# EAGLE board SMP (EAGLE 9.4.2)
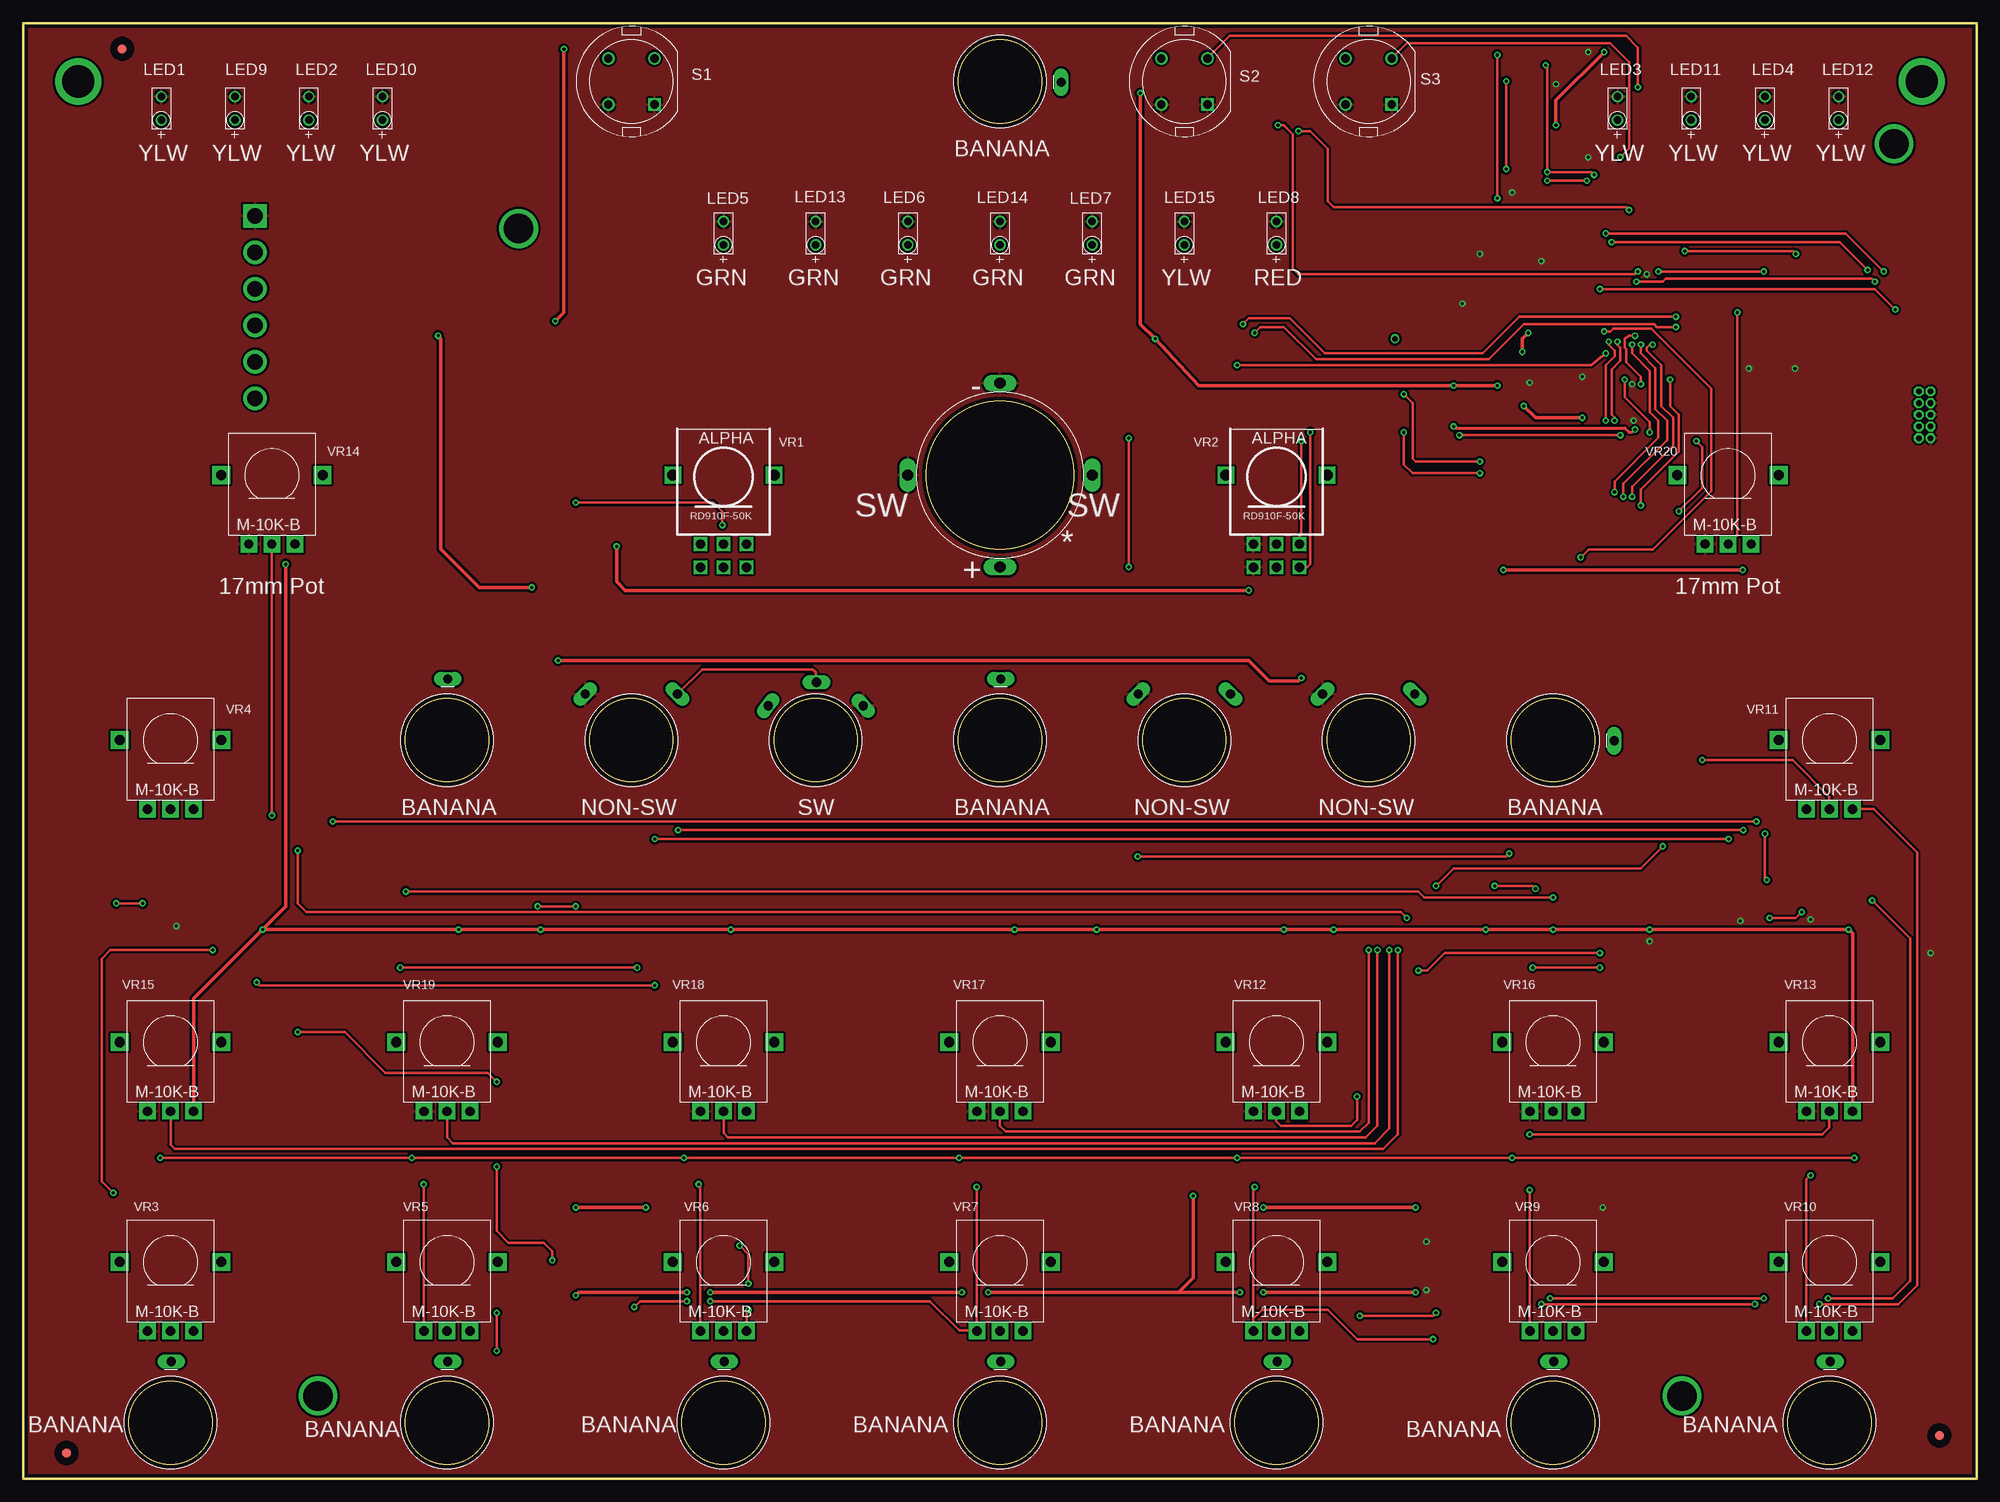
[diagram p5: board, top side]
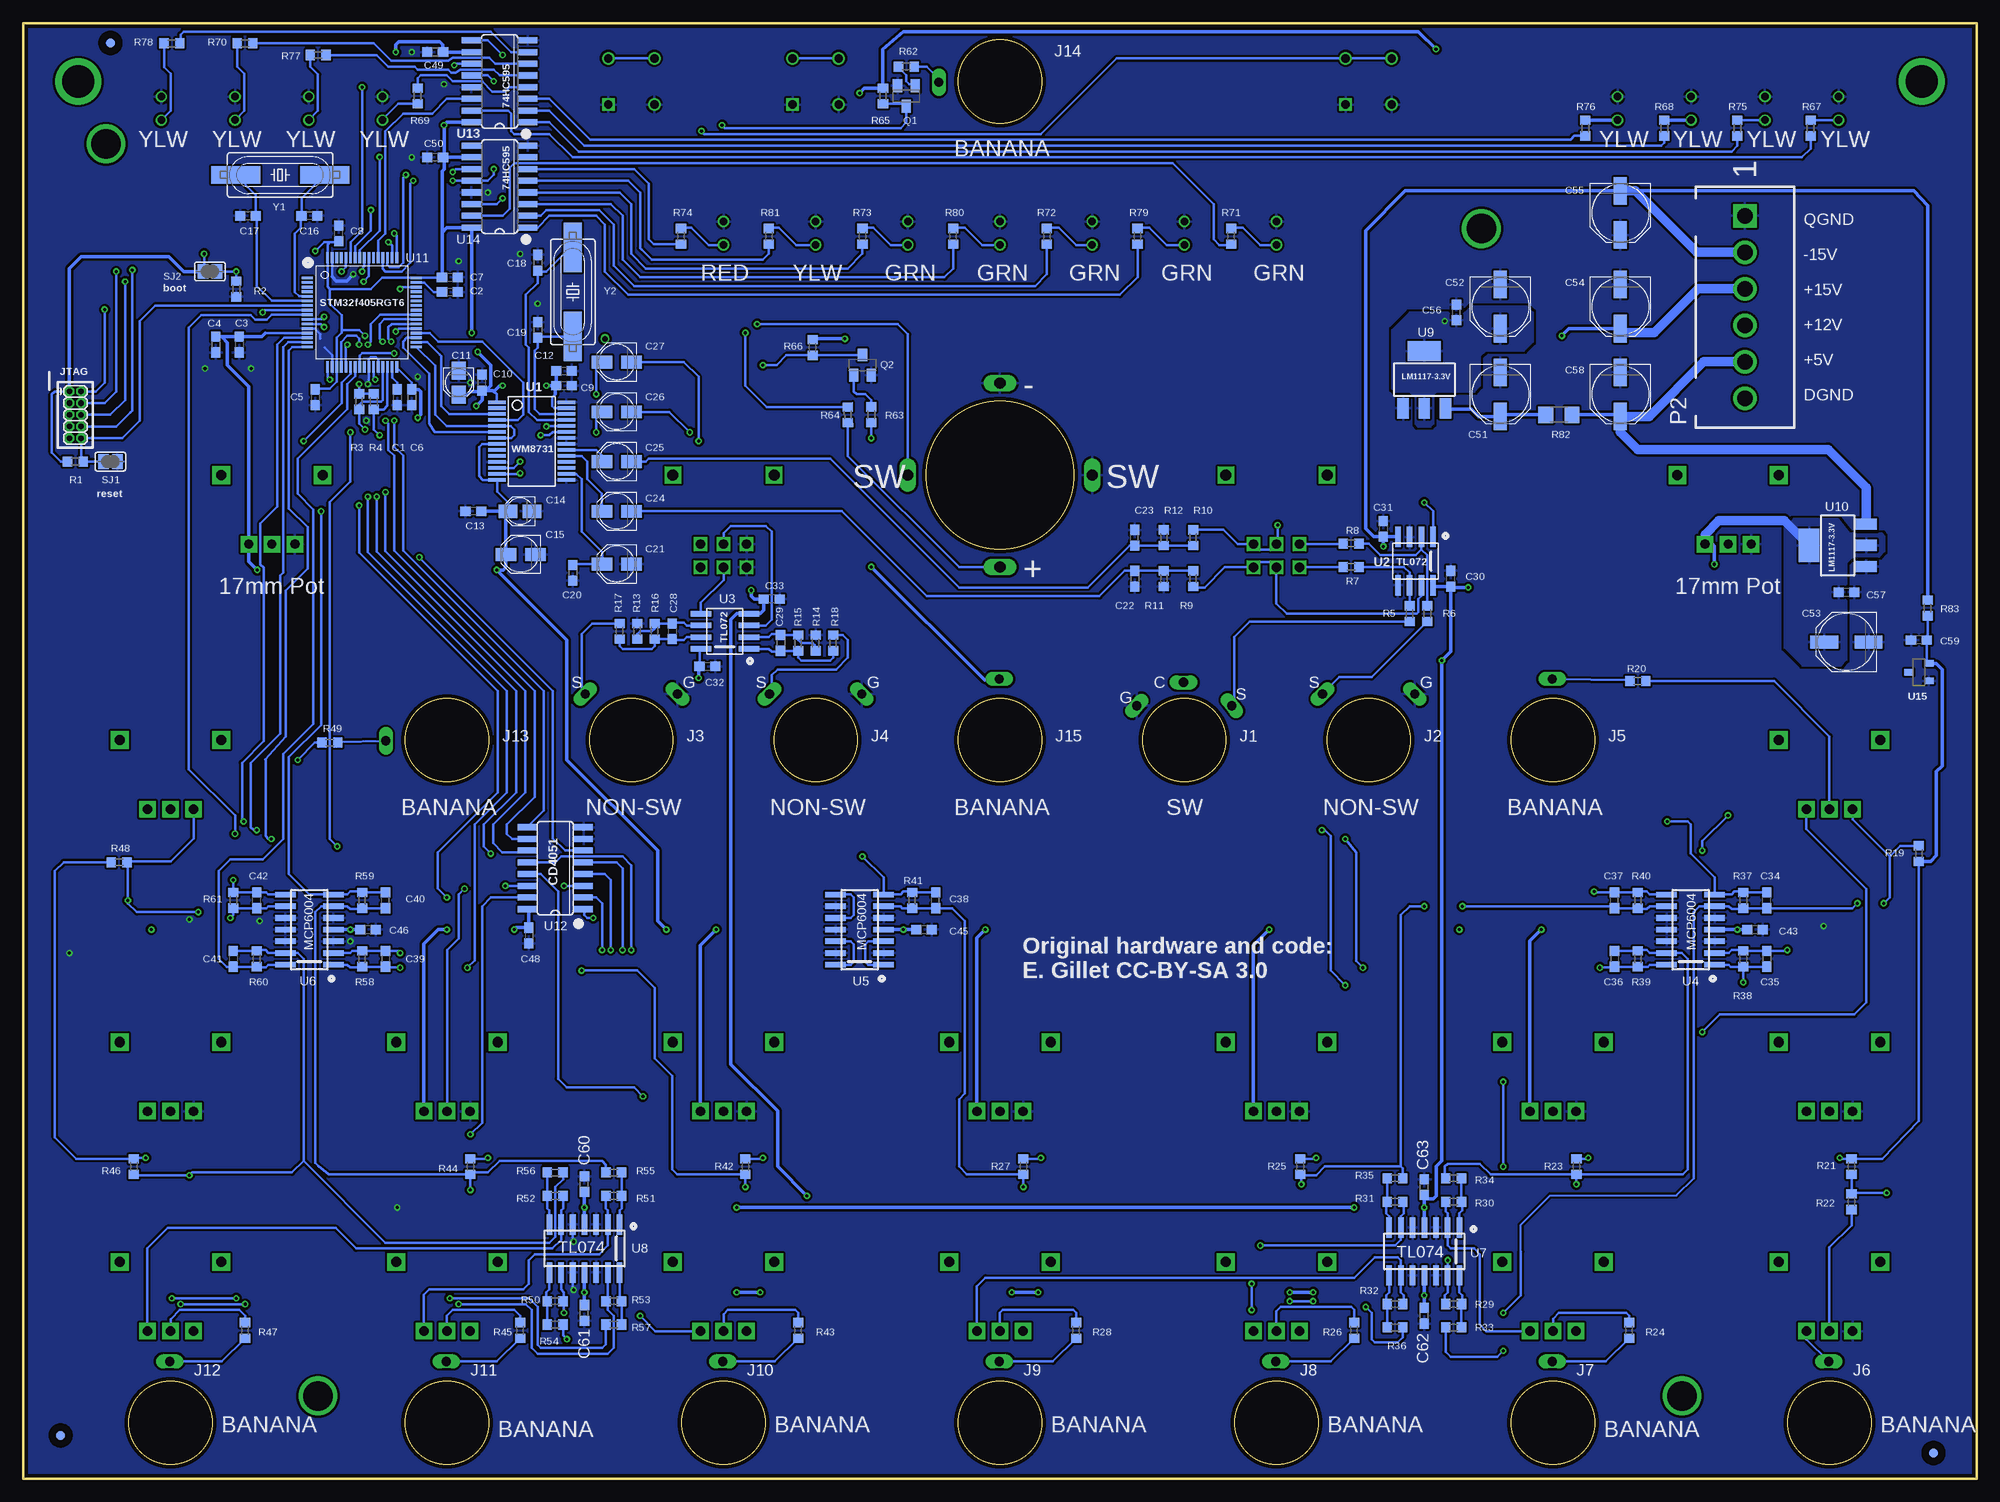
[diagram p6: board, bottom side, seen from below]

Size 212 x 158 mm. Coordinates in mm from the lower left corner, seen from the top.
Outline: 0,158 212,158 212,0 0,0 0,158
Copper layers (1*16): Top 0.0356mm / dielectric 1.5011mm / Bottom 0.0356mm
Design rules "LaenPCBOrder *": minimum track width 6mil, minimum drill 13mil, track to track 2mil, track to pad 2mil, pad to pad 2mil, via to via 6mil, smd to smd 2mil, copper to edge 15mil, drill to drill 6mil, minimum pad ring 6mil, minimum via ring 7mil, stop-mask expansion 3mil, vias tented up to drill 0mil, thermal gap 10mil
Net classes: 0 nets: width 0.203 mm, clearance 0.152 mm; 1 width: width 0.152 mm, clearance 0.152 mm

## Footprints (pad centres in the part's own frame; a part is rotated, then mirrored left to right if it is on the bottom)
C0603 = smd 1.1 x 1: 1 -0.85,0; 2 0.85,0
PANASONIC_A = smd 2 x 1.5: + 1.3,0; - -1.3,0
PANASONIC_B = smd 2.2 x 1.4: + 1.6,0; - -1.6,0
PANASONIC_D = smd 3 x 1.4: + 2.4,0; - -2.4,0
FIDUCIAL_1MM = smd 1 x 1: 1 0,0
SWITCH_JOHNSON = drill 1 long: C 0.08,6.27; G 5.16,3.73; S -5.16,3.73
SWITCH = drill 1 long: G -5,5; S 5,5
JOHNSON = drill 1 long: 1 0.08,6.635
LED_3MM_MIN = drill 0.813: A -1.27,0; K 1.27,0
2X5-1.27 = drill 0.61 pad 1.067 octagon: 1 -1.27,3.81; 2 0,3.81; 3 -1.27,2.54; 4 0,2.54; 5 -1.27,1.27; 6 0,1.27; 7 -1.27,0; 8 0,0; 9 -1.27,-1.27; 10 0,-1.27
MTA_156 = drill 1.7 square: 1 -9.9,0 | drill 1.7: 2 -5.94,0; 3 -1.98,0; 4 1.98,0; 5 5.94,0; 6 9.9,0
SOT23-BEC = smd 1 x 1.4: B -0.95,-1.1; C 0,1.1; E 0.95,-1.1
R0603 = smd 1 x 1.1: 1 -0.85,0; 2 0.85,0
R1206 = smd 1.6 x 1.803: 1 -1.422,0; 2 1.422,0
C&K_D6R = drill 0.9 square: 1 2.5,2.5 | drill 0.9: 2 2.5,-2.5; 3 -2.5,-2.5; 4 -2.5,2.5
MB16F = drill 1.2 long: 1 10,0; 2 -10,0; 3 0,10; 4 0,-10
SJ = smd 1.168 x 1.6: 1 -0.762,0; 2 0.762,0
SSOP28 = smd 0.381 x 1.905: 1 -4.55,-3.752; 2 -3.9,-3.752; 3 -3.25,-3.752; 4 -2.6,-3.752; 5 -1.95,-3.752; 6 -1.3,-3.752; 7 -0.65,-3.752; 8 0,-3.752; 9 0.65,-3.752; 10 1.3,-3.752; 11 1.95,-3.752; 12 2.6,-3.752; 13 3.25,-3.752; 14 3.9,-3.752; 15 3.9,3.752; 16 3.25,3.752; 17 2.6,3.752; 18 1.95,3.752; 19 1.3,3.752; 20 0.65,3.752; 21 0,3.752; 22 -0.65,3.752; 23 -1.3,3.752; 24 -1.95,3.752; 25 -2.6,3.752; 26 -3.25,3.752; 27 -3.9,3.752; 28 -4.55,3.752
SO08 = smd 0.61 x 2.21: 1 -1.905,-2.616; 2 -0.635,-2.616; 3 0.635,-2.616; 4 1.905,-2.616; 5 1.905,2.616; 6 0.635,2.616; 7 -0.635,2.616; 8 -1.905,2.616
SO14 = smd 0.6 x 2.2: 1 -3.81,-2.6; 2 -2.54,-2.6; 3 -1.27,-2.6; 4 0,-2.6; 5 1.27,-2.6; 6 2.54,-2.6; 7 3.81,-2.6; 8 3.81,2.6; 9 2.54,2.6; 10 1.27,2.6; 11 0,2.6; 12 -1.27,2.6; 13 -2.54,2.6; 14 -3.81,2.6
SOT223 = smd 1.219 x 2.235: 1 -2.311,-3.099; 2 0,-3.099; 3 2.311,-3.099 | smd 3.6 x 2.2: TAB 0,3.099
TQFP-10X10-64 = smd 1.2 x 0.3: 1 -5.936,3.75; 2 -5.936,3.25; 3 -5.936,2.75; 4 -5.936,2.25; 5 -5.936,1.75; 6 -5.936,1.25; 7 -5.936,0.75; 8 -5.936,0.25; 9 -5.936,-0.25; 10 -5.936,-0.75; 11 -5.936,-1.25; 12 -5.936,-1.75; 13 -5.936,-2.25; 14 -5.936,-2.75; 15 -5.936,-3.25; 16 -5.936,-3.75; 33 5.886,-3.75; 34 5.886,-3.25; 35 5.886,-2.75; 36 5.886,-2.25; 37 5.886,-1.75; 38 5.886,-1.25; 39 5.886,-0.75; 40 5.886,-0.25; 41 5.886,0.25; 42 5.886,0.75; 43 5.886,1.25; 44 5.886,1.75; 45 5.886,2.25; 46 5.886,2.75; 47 5.886,3.25; 48 5.886,3.75 | smd 0.3 x 1.2: 17 -3.75,-5.911; 18 -3.25,-5.911; 19 -2.75,-5.911; 20 -2.25,-5.911; 21 -1.75,-5.911; 22 -1.25,-5.911; 23 -0.75,-5.911; 24 -0.25,-5.911; 25 0.25,-5.911; 26 0.75,-5.911; 27 1.25,-5.911; 28 1.75,-5.911; 29 2.25,-5.911; 30 2.75,-5.911; 31 3.25,-5.911; 32 3.75,-5.911; 49 3.75,5.936; 50 3.25,5.936; 51 2.75,5.936; 52 2.25,5.936; 53 1.75,5.936; 54 1.25,5.936; 55 0.75,5.936; 56 0.25,5.936; 57 -0.25,5.936; 58 -0.75,5.936; 59 -1.25,5.936; 60 -1.75,5.936; 61 -2.25,5.936; 62 -2.75,5.936; 63 -3.25,5.936; 64 -3.75,5.936
SO16 = smd 0.66 x 2.032: 1 -4.445,-3.073; 2 -3.175,-3.073; 3 -1.905,-3.073; 4 -0.635,-3.073; 5 0.635,-3.073; 6 1.905,-3.073; 7 3.175,-3.073; 8 4.445,-3.073; 9 4.445,3.073; 10 3.175,3.073; 11 1.905,3.073; 12 0.635,3.073; 13 -0.635,3.073; 14 -1.905,3.073; 15 -3.175,3.073; 16 -4.445,3.073
DBZ_R-PDSO-G3 = smd 0.7 x 1: 1 -0.95,-1.1; 2 0.95,-1.1; 3 0,1.1
ALPHA902F = drill 1 square: 1R1 -2.5,-10; 1R2 -2.5,-7.5; 2R1 0,-10; 2R2 0,-7.5; 3R1 2.5,-10; 3R2 2.5,-7.5 | drill 1.2 square: K 5.5,0; L -5.5,0
ALPHA901F = drill 1 pad 1.778 square: 1 -2.5,-7.5; 2 0,-7.5; 3 2.5,-7.5 | drill 1.1 pad 1.93 square: H 5.5,0; I -5.5,0
HC49UP = smd 5.334 x 1.93: 1 -4.826,0; 2 4.826,0

## Placement (x,y rotation side)
C1  2.2u  [C0603]  171.41,117.38 270 bottom
C2  2.2u  [C0603]  165.69,128.81 0 bottom
C3  100n  [C0603]  188.55,123.1 270 bottom
C4  1u  [C0603]  191.09,123.1 270 bottom
C5  100n  [C0603]  180.3,117.38 270 bottom
C6  100n  [C0603]  169.82,117.38 270 bottom
C7  100n  [C0603]  165.69,130.4 0 bottom
C8  100n  [C0603]  177.75,135.16 90 bottom
C9  100n  [C0603]  153.31,118.66 0 bottom
C10  100n  [C0603]  162.2,118.97 90 bottom
C11  10u  [PANASONIC_A]  164.74,118.97 270 bottom
C12  1u  [C0603]  153.31,120.24 0 bottom
C13  100n  [C0603]  163.15,105 180 bottom
C14  10u  [PANASONIC_A]  158.07,105 180 bottom
C15  10u  [PANASONIC_B]  158,100.33 180 bottom
C16  18p  [C0603]  180.93,137.07 180 bottom
C17  18p  [C0603]  187.6,137.07 0 bottom
C18  18p  [C0603]  156.16,131.99 270 bottom
C19  18p  [C0603]  156.16,124.69 270 bottom
C20  100n  [C0603]  152.35,98.34 270 bottom
C21  10u  [PANASONIC_B]  147.59,99.29 180 bottom
C22  220p  [C0603]  91.39,97.7 270 bottom
C23  220p  [C0603]  91.39,102.14 90 bottom
C24  10u  [PANASONIC_B]  147.59,105 180 bottom
C25  10u  [PANASONIC_B]  147.59,110.4 180 bottom
C26  10u  [PANASONIC_B]  147.59,115.8 180 bottom
C27  10u  [PANASONIC_B]  147.59,121.19 180 bottom
C28  18p  [C0603]  141.56,91.98 270 bottom
C29  18p  [C0603]  129.81,90.72 270 bottom
C30  100n  [C0603]  57.1,97.7 90 bottom
C31  100n  [C0603]  64.41,103.1 270 bottom
C32  100n  [C0603]  137.75,88.17 0 bottom
C33  100n  [C0603]  130.76,95.48 180 bottom
C34  3.3n  [C0603]  22.81,62.77 90 bottom
C35  3.3n  [C0603]  22.81,56.42 270 bottom
C36  3.3n  [C0603]  39.33,56.42 270 bottom
C37  3.3n  [C0603]  39.33,62.77 90 bottom
C38  3.3n  [C0603]  112.98,62.77 90 bottom
C39  3.3n  [C0603]  172.68,56.42 270 bottom
C40  3.3n  [C0603]  172.68,62.77 90 bottom
C41  3.3n  [C0603]  189.19,56.42 270 bottom
C42  3.3n  [C0603]  186.64,62.77 90 bottom
C43  100n  [C0603]  24.08,59.6 0 bottom
C45  100n  [C0603]  114.25,59.6 0 bottom
C46  100n  [C0603]  174.58,59.6 0 bottom
C48  100n  [C0603]  157.12,58.97 270 bottom
C49  100n  [C0603]  167.28,154.85 180 bottom
C50  100n  [C0603]  167.28,143.42 180 bottom
C51  47u  [PANASONIC_D]  51.71,117.7 270 bottom
C52  47u  [PANASONIC_D]  51.71,127.23 270 bottom
C53  47u  [PANASONIC_D]  14.16,90.83 180 bottom
C54  47u  [PANASONIC_D]  38.69,127.23 270 bottom
C55  47u  [PANASONIC_D]  38.69,137.39 270 bottom
C56  100n  [C0603]  56.47,126.59 90 bottom
C57  100n  [C0603]  14.16,96.22 0 bottom
C58  47u  [PANASONIC_D]  38.69,117.7 270 bottom
C59  100n  [C0603]  6.31,91.03 180 bottom
C60  100n  [C0603]  151.09,31.98 90 bottom
C61  100n  [C0603]  151.09,18.01 90 bottom
C62  100n  [C0603]  59.96,17.69 90 bottom
C63  100n  [C0603]  59.96,31.66 90 bottom
FD1  FIDUCIAL  [FIDUCIAL_1MM]  10.75,155.2 90 top
FD2  FIDUCIAL  [FIDUCIAL_1MM]  4.72,2.8 0 top
FD3  FIDUCIAL  [FIDUCIAL_1MM]  207.92,4.7 0 top
FD4  FIDUCIAL  [FIDUCIAL_1MM]  202.52,155.83 0 bottom
FD5  FIDUCIAL  [FIDUCIAL_1MM]  4.72,2.8 0 bottom
FD6  FIDUCIAL  [FIDUCIAL_1MM]  207.92,4.7 0 bottom
J1  SWITCHCRAFT_42A  [SWITCH_JOHNSON]  86,80.17 0 top
J2  SWITCHCRAFT_JACK  [SWITCH]  66,80.17 0 top
J3  SWITCHCRAFT_JACK  [SWITCH]  146,80.17 0 top
J4  SWITCHCRAFT_JACK  [SWITCH]  126,80.17 0 top
J5  JOHNSON_BANANASTD  [JOHNSON]  46,80.17 0 top
J6  JOHNSON_BANANASTD  [JOHNSON]  16,6.09 0 top
J7  JOHNSON_BANANASTD  [JOHNSON]  46,6.09 0 top
J8  JOHNSON_BANANASTD  [JOHNSON]  76,6.09 0 top
J9  JOHNSON_BANANASTD  [JOHNSON]  106,6.09 0 top
J10  JOHNSON_BANANASTD  [JOHNSON]  136,6.09 0 top
J11  JOHNSON_BANANASTD  [JOHNSON]  166,6.09 0 top
J12  JOHNSON_BANANASTD  [JOHNSON]  196,6.09 0 top
J13  JOHNSON_BANANASTD  [JOHNSON]  166,80.17 270 top
J14  JOHNSON_BANANASTD  [JOHNSON]  106,151.66 270 top
J15  JOHNSON_BANANASTD  [JOHNSON]  106,80.17 0 top
LED1  Kingbright 754-1220  [LED_3MM_MIN]  15,148.74 90 top
LED2  Kingbright 754-1220  [LED_3MM_MIN]  31,148.74 90 top
LED3  Kingbright 754-1220  [LED_3MM_MIN]  173,148.74 90 top
LED4  Kingbright 754-1220  [LED_3MM_MIN]  189,148.74 90 top
LED5  754-1217-ND  [LED_3MM_MIN]  76,135.19 90 top
LED6  754-1217-ND  [LED_3MM_MIN]  96,135.19 90 top
LED7  754-1217-ND  [LED_3MM_MIN]  116,135.19 90 top
LED8  754-1219-ND  [LED_3MM_MIN]  136,135.19 90 top
LED9  Kingbright 754-1220  [LED_3MM_MIN]  23,148.74 90 top
LED10  Kingbright 754-1220  [LED_3MM_MIN]  39,148.74 90 top
LED11  Kingbright 754-1220  [LED_3MM_MIN]  181,148.74 90 top
LED12  Kingbright 754-1220  [LED_3MM_MIN]  197,148.74 90 top
LED13  754-1217-ND  [LED_3MM_MIN]  86,135.19 90 top
LED14  754-1217-ND  [LED_3MM_MIN]  106,135.19 90 top
LED15  Kingbright 754-1220  [LED_3MM_MIN]  126,135.19 90 top
P1  M05X2MINIJTAG  [2X5-1.27]  205.69,114.21 0 bottom
P2  BU_PWR_NO_I2C  [MTA_156]  25.18,127.17 270 bottom
Q1  MMBT3904  [SOT23-BEC]  116.16,150.09 180 bottom
Q2  MMBT3904  [SOT23-BEC]  120.92,120.88 0 bottom
R1  10k  [R0603]  206.33,110.4 180 bottom
R2  10k  [R0603]  188.87,129.13 90 bottom
R3  2.2k  [R0603]  175.53,116.91 90 bottom
R4  2.2k  [R0603]  173.94,116.91 90 bottom
R5  22k  [R0603]  61.55,93.89 270 bottom
R6  22k  [R0603]  59.65,93.89 270 bottom
R7  3.3k  [R0603]  67.9,98.97 0 bottom
R8  3.3k  [R0603]  67.9,101.51 0 bottom
R9  5.6k  [R0603]  85.05,97.7 270 bottom
R10  5.6k  [R0603]  85.05,102.14 90 bottom
R11  5.6k  [R0603]  88.22,97.7 90 bottom
R12  5.6k  [R0603]  88.22,102.14 270 bottom
R13  5K6  [R0603]  145.37,91.98 90 bottom
R14  5K6  [R0603]  126,90.72 90 bottom
R15  47k  [R0603]  127.91,90.72 90 bottom
R16  47k  [R0603]  143.47,91.98 90 bottom
R17  1.0k  [R0603]  147.28,91.98 270 bottom
R18  1.0k  [R0603]  124.1,90.72 270 bottom
R19  100k  [R0603]  6.31,67.86 90 bottom
R20  100k  [R0603]  36.78,86.59 0 bottom
R21  180k  [R0603]  13.61,33.88 270 bottom
R22  100k  [R0603]  13.61,30.07 90 bottom
R23  100k  [R0603]  43.45,33.88 270 bottom
R24  100k  [R0603]  37.74,16.1 90 bottom
R25  100k  [R0603]  73.42,33.88 270 bottom
R26  100k  [R0603]  67.58,16.1 90 bottom
R27  100k  [R0603]  103.46,33.88 270 bottom
R28  100k  [R0603]  97.75,16.1 90 bottom
R29  16.5k  [R0603]  56.79,18.96 0 bottom
R30  16.5k  [R0603]  56.79,30.07 0 bottom
R31  16.5k  [R0603]  63.14,30.07 180 bottom
R32  16.5k  [R0603]  63.14,18.96 180 bottom
R33  16.5k  [R0603]  56.79,16.42 180 bottom
R34  16.5k  [R0603]  56.79,32.61 180 bottom
R35  16.5k  [R0603]  63.14,32.61 0 bottom
R36  16.5k  [R0603]  63.14,16.42 0 bottom
R37  16.5k  [R0603]  25.36,62.77 90 bottom
R38  47k  [R0603]  25.36,56.42 270 bottom
R39  16.5k  [R0603]  36.78,56.42 270 bottom
R40  16.5k  [R0603]  36.78,62.77 90 bottom
R41  16.5k  [R0603]  115.53,62.77 90 bottom
R42  100k  [R0603]  133.62,33.88 270 bottom
R43  100k  [R0603]  127.91,16.1 90 bottom
R44  100k  [R0603]  163.47,33.88 270 bottom
R45  100k  [R0603]  158.07,16.1 90 bottom
R46  100k  [R0603]  199.98,33.88 270 bottom
R47  100k  [R0603]  187.92,16.1 90 bottom
R48  100k  [R0603]  201.57,66.9 0 bottom
R49  100k  [R0603]  178.7,79.89 180 bottom
R50  16.5k  [R0603]  154.26,19.28 180 bottom
R51  16.5k  [R0603]  147.91,30.71 0 bottom
R52  16.5k  [R0603]  154.26,30.71 180 bottom
R53  16.5k  [R0603]  147.91,19.28 0 bottom
R54  16.5k  [R0603]  154.26,16.74 0 bottom
R55  16.5k  [R0603]  147.91,33.25 180 bottom
R56  16.5k  [R0603]  154.26,33.25 0 bottom
R57  16.5k  [R0603]  147.91,16.74 180 bottom
R58  16.5k  [R0603]  175.22,56.42 270 bottom
R59  16.5k  [R0603]  175.22,62.77 90 bottom
R60  16.5k  [R0603]  186.64,56.42 270 bottom
R61  16.5k  [R0603]  189.19,62.77 90 bottom
R62  100k  [R0603]  116.16,153.26 180 bottom
R63  100k  [R0603]  119.97,115.48 90 bottom
R64  100  [R0603]  122.51,115.48 270.9 bottom
R65  10k  [R0603]  118.7,150.09 90 bottom
R66  10k  [R0603]  126.32,122.78 90 bottom
R67  1K  [R0603]  18.05,146.59 270 bottom
R68  1K  [R0603]  33.93,146.59 270 bottom
R69  1K  [R0603]  169.18,150.09 90 bottom
R70  1K  [R0603]  187.92,155.8 0 bottom
R71  100R  [R0603]  80.92,134.85 270 bottom
R72  100R  [R0603]  100.92,134.85 270 bottom
R73  100R  [R0603]  120.92,134.85 270 bottom
R74  100R  [R0603]  140.61,134.85 270 bottom
R75  1K  [R0603]  25.99,146.59 270 bottom
R76  1K  [R0603]  42.5,146.59 270 bottom
R77  1K  [R0603]  179.98,154.53 0 bottom
R78  1K  [R0603]  195.85,155.8 0 bottom
R79  100R  [R0603]  91.08,134.85 270 bottom
R80  100R  [R0603]  111.08,134.85 270 bottom
R81  100R  [R0603]  131.08,134.85 270 bottom
R82  4.7  [R1206]  45.36,115.48 180 bottom
R83  470  [R0603]  5.35,94.53 270 bottom
S1  [C&K_D6R]  66,151.66 270 top
S2  [C&K_D6R]  126,151.66 270 top
S3  [C&K_D6R]  146,151.66 270 top
S4  ATI_MB16F-Y  [MB16F]  106,108.94 180 top
SJ1  RESET  [SJ]  202.52,110.4 180 bottom
SJ2  BOOT  [SJ]  191.72,131.04 180 bottom
U1  WM8731  [SSOP28]  156.8,112.31 270 bottom
U2  TL072  [SO08]  60.91,99.61 180 bottom
U3  TL072  [SO08]  135.84,91.98 90 bottom
U4  MCP6004  [SO14]  31.07,59.6 90 bottom
U5  MCP6004  [SO14]  121.24,59.6 90 bottom
U6  MCP6004  [SO14]  180.93,59.6 90 bottom
U7  TL074  [SO14]  59.96,24.67 180 bottom
U8  TL074  [SO14]  151.09,24.99 180 bottom
U9  LM1117MPX-3.3  [SOT223]  59.96,119.29 0 bottom
U10  LM1117MPX-3.3  [SOT223]  15.11,101.31 90 bottom
U11  STM32F405RGT6  [TQFP-10X10-64]  175.22,126.59 0 bottom
U12  4051D  [SO16]  154.26,66.27 90 bottom
U13  74HC595D  [SO16]  160.29,151.68 90 bottom
U14  74HC595D  [SO16]  160.29,140.25 90 bottom
U15  LM4040B10  [DBZ_R-PDSO-G3]  6.31,87.54 90 bottom
VR1  ALPHA-RD910F-50k  [ALPHA902F]  76,108.94 0 top
VR2  ALPHA-RD910F-50k  [ALPHA902F]  136,108.94 0 top
VR3  M-10K-B  [ALPHA901F]  16,23.53 0 top
VR4  M-10K-B  [ALPHA901F]  16,80.17 0 top
VR5  M-10K-B  [ALPHA901F]  46,23.53 0 top
VR6  M-10K-B  [ALPHA901F]  76,23.53 0 top
VR7  M-10K-B  [ALPHA901F]  106,23.53 0 top
VR8  M-10K-B  [ALPHA901F]  136,23.53 0 top
VR9  M-10K-B  [ALPHA901F]  166,23.53 0 top
VR10  M-10K-B  [ALPHA901F]  196,23.53 0 top
VR11  M-10K-B  [ALPHA901F]  196,80.17 0 top
VR12  M-10K-B  [ALPHA901F]  136,47.39 0 top
VR13  M-10K-B  [ALPHA901F]  196,47.39 0 top
VR14  M-10K-B  [ALPHA901F]  27,108.94 0 top
VR15  M-10K-B  [ALPHA901F]  16,47.39 0 top
VR16  M-10K-B  [ALPHA901F]  166,47.39 0 top
VR17  M-10K-B  [ALPHA901F]  106,47.39 0 top
VR18  M-10K-B  [ALPHA901F]  76,47.39 0 top
VR19  M-10K-B  [ALPHA901F]  46,47.39 0 top
VR20  M-10K-B  [ALPHA901F]  185,108.94 0 top
Y1  8MHz  [HC49UP]  184.11,141.51 0 bottom
Y2  12.288MHz  [HC49UP]  152.35,128.81 90 bottom

## Tracks (layer width: path | path; a pad name or v marks a point on that pad's centre or on a via)
+3V3  (via drill 0.33)
  Top 0.254: v180.3,133.26 192.04,133.26 v192.36,132.94 | v175.53,118.81 175.53,119.61 173.94,121.19 173.94,122.62 173.79,122.78 173.79,123.73 174.26,124.05 v174.9,124.05
  Top 0.406: v58.69,155.17 58.69,126.59 v57.74,125.64 | v121.24,150.41 121.24,125.32 v122.83,123.73 127.59,118.66 v155.21,118.66 v159.97,118.66 | v162.83,116.43 164.1,115.16 v169.18,115.16 | v162.67,122.31 162.67,123.73 v163.31,124.37 | v166.32,146.91 166.32,149.61 v171.56,154.85
  Bottom 0.254: U11.32 171.47,120.62 169.82,118.97 C6.1 | R4.2 R3.2 v175.53,118.81 | 166.32,143.52 C50.1 166.32,143.32 | R1.2 207.92,110.4 208.87,111.35 208.87,117.7 208.55,118.02 P1.1 | 178.71,134.21 178.97,133.95 U11.64 178.97,129.39 178.71,129.13 | C8.1 177.86,134.21 178.71,134.21 | C7.1 166.6,130.34 U11.48 173.05,130.34 174.26,129.13 178.71,129.13 | C5.1 180.19,118.34 178.71,118.34 177.97,119.08 U11.19 177.97,123.84 177.44,124.37 177.44,124.69 | U1.27 154.35,116.2 154.58,116.43 154.58,117.38 154.26,117.7 | 154.26,118.55 C9.1 | 161.03,118.12 160.93,118.02 160.61,117.7 160.61,116.91 U1.1 | v180.3,133.26 179.34,134.21 178.71,134.21 | v192.36,132.94 192.36,131.16 SJ2.2 | 178.71,129.13 178.71,127.55 177.44,126.28 177.44,124.69 | v174.9,124.05 175.53,124.69 177.44,124.69 | C10.1 161.78,118.12
  Bottom 0.406: U14.10 C50.1 | U13.16 166.01,147.23 v166.32,146.91 166.32,143.52 | U13.10 C49.1 166.48,154.91 166.48,155.64 166.8,155.96 171.25,155.96 171.56,155.64 v171.56,154.85 | 166.54,135.27 166.01,135.8 U14.16 163.31,135.74 v163.31,124.37 | 166.32,143.32 166.32,142.15 166.54,141.94 166.54,135.27 | P1.1 206.97,131.35 205.69,132.62 196.17,132.62 194.58,131.04 SJ2.2 | C7.1 166.54,135.27 | v58.69,155.17 60.6,157.07 116.48,157.07 118.7,155.17 R65.2 120.71,150.94 v121.24,150.41 | 154.26,117.7 154.26,118.55 | v155.21,118.66 C9.1 C12.1 | v159.97,118.66 160.29,118.66 160.93,118.02 | C10.1 162.2,117.07 v162.83,116.43 | v122.83,123.73 126.22,123.73 R66.2 | C6.1 169.08,118.23 168.87,118.02 168.87,115.48 v169.18,115.16 | C11.+ 163.81,117.67 163.47,118.02 162.3,118.02 C10.1 | 161.78,118.12 161.25,118.66 161.25,120.88 v162.67,122.31 | 161.03,118.12 C10.1
  pour Bottom (isolate 0.406): 48.85,127.23 54.88,127.23 55.52,126.59 61.55,126.59 63.45,124.69 63.45,118.34 63.14,118.02 61.55,118.02 60.91,117.38 60.91,114.53 60.6,114.21 59.33,114.21 59.01,114.53 59.01,117.7 58.69,118.02 54.56,118.02 53.93,118.66 53.93,121.83 53.3,122.47 49.17,122.47 48.22,123.42 48.22,126.59
+3V3_A  (via drill 0.33, 0.35)
  Top 0.406: v25.99,59.6 v47.26,59.6 v56.15,59.6 v76.79,59.6 v107.59,59.6 v116.48,59.6 v136.8,59.6 v142.19,59.6 v158.7,59.6 v166.01,59.6 v176.49,59.6 v198.07,59.6 198.5,59.17 VR13.3 | VR15.3 18.5,52.11 v25.99,59.6 | v186.6,98.65 v160.61,98.65 | v25.99,59.6 28.5,62.11 v28.5,99.25
  Bottom 0.254: U11.13 185.72,124.34 | U1.8 162.2,112.31 162.51,111.99 162.51,108.81 162.11,108.41 U1.14 160.55,107.17 159.34,105.95 159.34,105.03 C14.+ 159.6,104.77
  Bottom 0.406: C43.1 v25.99,59.6 U4.4 | C46.1 v176.49,59.6 U6.4 | 185.72,124.34 186.11,123.95 C3.1 190.45,123.95 | C4.1 190.45,123.95 | C13.1 C14.+ | 159.6,104.77 C15.+ 159.6,98.97 159.92,98.65 v160.61,98.65 152.99,91.03 152.99,78.02 143.15,68.17 143.15,60.55 v142.19,59.6 | VR19.3 48.5,58.36 v47.26,59.6 | VR18.3 78.5,57.89 v76.79,59.6 | VR17.3 108.5,58.69 v107.59,59.6 | C45.1 v116.48,59.6 U5.4 | VR12.3 138.5,57.9 v136.8,59.6 | VR16.3 168.5,58.06 166.96,59.6 v166.01,59.6 | v158.7,59.6 158.49,59.81 C48.1 157.12,61.61 U12.16 | 190.45,123.95 189.82,123.31 189.82,120.88 187.5,118.56 VR20.3 187.5,99.56 v186.6,98.65 | v28.5,99.25 28.5,101.25 28.69,101.44 VR14.3
  Bottom 1.016: U10.TAB 20.91,104 28,104 29.5,102.5 VR14.3
  pour Bottom (isolate 0.406): 15.11,104.16 19.88,104.16 20.83,103.21 20.83,90.19 18.92,88.29 14.8,88.29 14.16,88.92 14.16,99.4 13.53,100.03 10.67,100.03 10.03,100.67 10.03,102.26 10.35,102.58 13.84,102.58
+5V
  Bottom 0.406: R82.1 38.87,115.48 C58.+
  Bottom 1.016: 12,103.63 U10.3 12.02,107.57 16.15,111.7 36.78,111.7 38.69,113.61 C58.+ 35.56,115.3 29.62,121.23 P2.5
ADC_EN  (via drill 0.33, 0.35)
  Top 0.254: v171.56,124.53 172.2,124.53 172.52,124.85 176.64,124.85 183.15,118.34 183.15,107.22 176.8,100.88 169.88,100.88 v169,100
  Bottom 0.254: U11.37 171.25,124.84 v171.56,124.53 | U12.6 153.17,68.17 154.5,69.5 154.5,85.5 v169,100
ADC_POT  (via drill 0.33)
  Top 0.254: v153.31,64.36 155.21,66.27 175.53,66.27 v177.91,68.65 | v173.79,119.29 173.79,117.38 176.49,114.69 v176.49,113.58
  Bottom 0.254: v153.31,64.36 U12.3 | v177.91,68.65 178.71,69.44 178.71,106 176.49,108.22 v176.49,113.58 | U11.27 173.97,119.47 v173.79,119.29
ADC_S0  (via drill 0.33)
  Top 0.254: v174.58,123.1 174.58,122.15 176.49,120.24 176.49,115.8 177.44,114.84 177.44,113 172.68,108.24 v172.68,107.07
  Bottom 0.254: U11.40 173.24,126.34 174.26,125.32 174.26,123.42 v174.58,123.1 | v172.68,107.07 172.68,100.67 157.5,85.5 157.5,74.5 161,71 161,69 160,68 157.51,68 U12.11
ADC_S1  (via drill 0.33)
  Top 0.254: v172.68,114.84 172.68,115.16 172.36,115.48 172.36,120.4 173.31,121.35 173.31,122.78 172.99,123.1 v172.99,123.42
  Bottom 0.254: U11.39 172.79,125.84 173.31,125.32 173.31,123.73 v172.99,123.42 | v172.68,114.84 172.36,114.53 172.36,111.67 171.72,111.03 171.72,100.72 156.5,85.5 156.5,74 159.5,71 159.5,70 158.94,69.44 U12.10
ADC_S2  (via drill 0.33)
  Top 0.254: v171.72,114.84 171.72,120.88 172.68,121.83 172.68,122.47 172.04,123.1 v172.04,123.42
  Bottom 0.254: U11.38 172.02,125.34 172.36,125 172.36,123.73 v172.04,123.42 | v171.72,114.84 171.72,111.99 170.77,111.03 170.77,100.77 155.5,85.5 155.5,72.55 U12.9
AREF_-10  (via drill 0.33)
  Top 0.254: v14.88,34.84 v42.18,34.84 v71.71,34.84 v101.56,34.84 v131.72,34.84 v161.56,34.84 v198.71,34.84
  Bottom 0.254: R19.1 6.31,38.86 10.27,34.73 R21.1 14.78,34.73 v14.88,34.84 | R83.2 5.35,91.77 C59.1 5.45,88.74 U15.2 | v42.18,34.84 42.28,34.73 R23.1 | R25.1 71.81,34.73 v71.71,34.84 | R27.1 101.66,34.73 v101.56,34.84 | R42.1 131.82,34.73 v131.72,34.84 | R44.1 161.66,34.73 v161.56,34.84 | v198.71,34.84 199.88,34.84 R46.1 206.23,34.73 208.55,37.06 208.55,65.95 207.6,66.9 R48.1
  Bottom 0.406: R19.1 5.03,67 4.4,67.64 4.4,76.75 3.77,77.38 3.77,87.86 4.4,88.49 U15.2
BALANCE_CV  (via drill 0.33)
  Top 0.254: v120.92,67.54 160.93,67.54 v161.25,67.86 | v175.53,123.1 175.53,122.15 177.12,120.56 177.12,116.12 178.39,114.84 178.39,112.75 173.63,107.99 v173.63,106.59
  Bottom 0.254: U11.20 177.47,123.39 176.8,124.05 175.85,124.05 175.53,123.73 v175.53,123.1 | v120.92,67.54 118.64,65.25 U5.7 116.8,63.41 116.48,63.73 115.63,63.73 R41.2 C38.2 | v173.63,106.59 173.63,100.63 158.5,85.5 158.5,74.5 162,71 162,68.61 v161.25,67.86
BALANCE_POT  (via drill 0.33)
  Top 0.254: VR17.2 106,38.33 106.64,37.69 145.05,37.69 146,38.65 v146,57.38
  Bottom 0.254: U12.12 154.26,66.9 153.62,67.54 146.96,67.54 146,66.59 v146,57.38
BOOT_FLASH  (via drill 0.33)
  Top 0.254: v177.44,131.04 v188.87,131.04
  Bottom 0.254: U11.60 176.97,131.51 v177.44,131.04 | SJ2.1 v188.87,131.04 R2.2
DENSITY_CV  (via drill 0.33)
  Top 0.254: v68.53,69.44 v185.06,69.44 | v66.63,55.47 v40.91,55.47
  Bottom 0.254: v68.53,69.44 67.37,67.96 67.37,56.21 v66.63,55.47 | U11.16 182.78,122.84 183.15,122.47 183.15,105.32 181.12,103.29 181.12,98.78 183.47,96.43 183.47,80.56 185.73,78.05 185.69,78.01 185.69,69.76 185.38,69.44 v185.06,69.44 | v40.91,55.47 39.43,55.47 C36.2 R39.2 35.73,55.58 35.52,55.79 U4.14
DENSITY_POT  (via drill 0.33)
  Top 0.254: VR19.2 46,37.05 46.63,36.42 146.64,36.42 148.23,38.01 v148.23,57.38
  Bottom 0.254: U12.4 148.86,65.63 148.23,65 v148.23,57.38
FEEDBACK_CV  (via drill 0.33)
  Top 0.254: v181.56,112.62 182.2,111.99 182.2,107.54 v179.66,105
  Bottom 0.254: U11.22 176.47,119.94 177.44,118.97 177.44,116.75 v181.56,112.62 | C40.2 R59.2 175.32,63.73 176.49,63.73 176.8,63.41 U6.7 180.93,63.41 183.15,65.63 183.15,78.33 179.66,81.83 v179.66,105
FEEDBACK_POT  (via drill 0.33)
  Top 0.254: v159.66,64.36 163.78,64.36 v164.1,64.05
  Bottom 0.254: VR16.2 166,57.39 164.74,58.65 164.74,63.41 v164.1,64.05 | U12.14 v159.66,64.36
GATE_CAPT  (via drill 0.33)
  Top 0.254: v136.16,146.91 136.8,146.91 136.96,146.75 137.12,146.59 137.75,145.96 137.75,131.35 138.38,130.72 174.9,130.72 v175.22,131.04
  Bottom 0.254: R65.1 116.41,149.24 Q1.C 116.16,147.23 116.8,146.59 135.84,146.59 v136.16,146.91 | U11.56 174.97,131.6 175.22,131.35 v175.22,131.04
GATE_FREEZE  (via drill 0.33)
  Top 0.254: v171.72,122.15 170.13,120.88 v131.72,120.88
  Bottom 0.254: U11.24 175.47,121.9 175.22,122.15 v171.72,122.15 | Q2.C 126.28,121.98 R66.1 129.18,121.93 130.23,120.88 v131.72,120.88
GND  (via drill 0.33, 0.35)
  Bottom 0.254: v174.58,118.81 174.47,119.25 U11.26 174.47,121.53 174.26,121.74 173.74,121.74 173.47,121.47 U11.28 | U11.18 178.47,121.97 179.25,122.75 | U11.12 180.34,124.84 179.75,124.25 179.75,123.75 | U11.63 178.47,130.47 | U8.10 152.35,20.6 v152.25,20.5 | U8.5 152.35,25.85 v152.25,25.75
  Bottom 0.406: 178.47,130.47 178,130 176.89,130 v176.17,130.72
  other vias: 193.95,60.71 186.33,60.55 176.49,58.33 169.82,143.42 161.56,139.61 156.16,127.55 158.07,132.94 206.97,57.06 169.18,119.61 163.47,118.97 174.74,114.84 164.74,132.15 169.82,154.85 166.32,151.36 16.62,60 187.25,120.5 192.25,120.5 171.41,29.44
  pour Bottom (isolate 0.254, rank 4): 0,0 212,0 212,158 0,158
  pour Top (isolate 0.254): 0,158 212,158 212,0 0,0
GRAIN_CV  (via drill 0.33, 0.35)
  Top 0.254: v189.19,65 189,65.18 v189,70
  Bottom 0.254: U11.9 184.99,126.34 185.53,125.8 186.8,125.8 187.28,126.28 192.68,126.28 194,124.95 194,77 189,72 v189,70 | v189.19,65 R61.2 C42.2 185.59,63.62 185.38,63.41 U6.8
GRAIN_POT  (via drill 0.33)
  Top 0.254: v186.01,126.59 186.01,102.37 185.07,101.44 VR20.2
  Bottom 0.254: U11.8 185.76,126.84 v186.01,126.59
I2C_SCL  (via drill 0.33)
  Top 0.254: 155.37,114.05 v155.21,114.21
  Top 0.33: 155.37,114.05 173.79,114.05 174.26,113.58 174.58,113.58 v174.9,113.89
  Bottom 0.254: U1.24 155.17,114.25 v155.21,114.21 | U11.29 172.97,117.09 173.15,116.91 175.22,116.91 175.53,116.59 R3.1 175.53,114.53 v174.9,113.89
I2C_SDA  (via drill 0.33)
  Top 0.254: v155.85,113.26 v173.31,113.26
  Bottom 0.254: U1.23 154.55,113.6 154.9,113.26 v155.85,113.26 | v173.31,113.26 173.94,113.89 R4.1 172.89,116.06 172.47,116.48 U11.30
I2S_LRCK
  Bottom 0.254: U1.7 159.01,112.95 158.7,113.26 158.7,113.89 159.07,114.25 U1.5 166.05,114.25 167.28,115.48 167.28,120.79 U11.33
I2S_SCK
  Bottom 0.254: U11.34 168.16,123.34 166.8,121.99 166.64,121.83 166.64,116.43 165.76,115.56 U1.3
I2S_SIN
  Bottom 0.254: U11.35 170.34,123.84 170.77,123.42 170.77,122.78 167.91,119.92 167.91,114.53 167.31,113.6 U1.6
I2S_SOUT
  Bottom 0.254: U1.4 158.33,114.91 157.75,115.48 157.75,118.97 162.2,123.42 166.96,123.42 167.88,124.34 U11.36
JTCK  (via drill 0.33)
  Top 0.254: v171.72,135.16 197.76,135.16 v201.88,131.04
  Bottom 0.254: U11.49 171.47,134.91 v171.72,135.16 | v201.88,131.04 201.88,118.02 203.16,116.75 P1.4
JTDI  (via drill 0.33)
  Top 0.254: v172.36,134.21 197.12,134.21 v200.14,131.2
  Bottom 0.254: U11.50 171.97,133.82 v172.36,134.21 | P1.8 201.88,114.21 200.38,115.72 200.3,115.8 200.14,115.96 v200.14,131.2
JTDO  (via drill 0.33)
  Top 0.254: v175.06,129.93 177.9,129.93 178.24,130.26 200.6,130.26 v200.93,129.93
  Bottom 0.254: P1.6 202.52,115.48 200.93,117.07 v200.93,129.93 | U11.55 174.47,130.52 v175.06,129.93
JTMS  (via drill 0.33)
  Top 0.254: v171.09,129.13 200.93,129.13 v203.16,126.91
  Bottom 0.254: U11.46 170.88,129.34 v171.09,129.13 | v203.16,126.91 203.16,118.97 204.11,118.02 P1.2
LED_DATA
  Bottom 0.254: U11.53 173.47,134.38 172.68,135.16 172.68,146.28 170.77,148.18 167.59,148.18 166.01,149.77 U13.14
LED_EN  (via drill 0.33)
  Top 0.254: v160.93,151.68 v160.93,142.15 | v165.37,140.88 v169.66,140.88
  Bottom 0.254: v160.93,151.68 161.56,152.31 U13.12 | U11.52 172.97,131.33 172.68,131.04 170.93,131.04 169.98,131.99 169.98,140.56 v169.66,140.88 | v160.93,142.15 160.93,141.51 161.56,140.88 U14.12 v165.37,140.88
LED_FREEZE  (via drill 0.33)
  Top 0.254: v133.62,124.37 134.26,125 136.8,125 140.29,121.51 159.02,121.51 162.83,125.32 176.96,125.32 177.28,125 v179.34,125
  Bottom 0.254: R64.1 131.3,116.33 133.62,118.66 v133.62,124.37 | U11.11 179.68,125.34 v179.34,125
LED_SCK  (via drill 0.33)
  Top 0.254: v170.45,141.51 170.13,141.83 v165.37,141.83 165.37,153.26 v165.21,153.42
  Bottom 0.254: U11.51 172.47,131.78 172.2,131.51 171.25,131.51 170.77,131.99 170.77,141.2 v170.45,141.51 | U14.11 165.06,142.15 v165.37,141.83 | U13.11 165.06,153.58 v165.21,153.42
LIN
  Bottom 0.254: U1.20 149.8,111.66 149.18,111.03 149.18,110.41 C25.+
LOUT  (via drill 0.33)
  Top 0.254: v158.07,110.4 151.09,110.4 150.77,110.72 150.77,116.75 v149.81,117.7
  Bottom 0.254: U1.12 158.76,109.7 v158.07,110.4 | v149.81,117.7 149.81,120.57 C27.+
LOUT_JACK
  Bottom 0.254: R18.1 123.04,91.56 122.51,91.03 122.51,89.13 123.78,87.86 130.13,87.86 130.76,87.22 130.76,85.27 J4.S
N$1
  Bottom 0.254: R24.1 40.26,12.73 J7.1
N$2
  Bottom 0.254: R43.2 127.91,18.01 128.22,18.33 135.53,18.33 136,17.85 VR8.2
N$3  (via drill 0.33)
  Top 0.254: v139.66,113.58 139.66,99.29 139.34,98.97 138.61,98.97 VR2.3R1
  Bottom 0.254: C26.- 141.88,115.8 v139.66,113.58
N$4  (via drill 0.33)
  Top 0.254: VR5.1 43.5,31.93 v43.45,31.98
  Bottom 0.254: v43.45,31.98 R23.2 | R23.2 52.76,33.03 53.93,34.2 57.42,34.2 57.74,33.88 57.74,32.72 R34.2 | R23.2 31.92,33.03 31.39,33.56 31.39,56.42 32.02,57.06 U4.13 35.52,57.06 35.83,57.38 36.68,57.38 R39.1 C36.1
N$5
  Bottom 0.254: R30.1 57.64,29.02 57.42,28.8 U7.2 57.42,25.31 57.1,24.99 54.56,24.99 53.93,24.36 53.93,16.74 53.22,16.03 VR5.3
N$6
  Bottom 0.254: U7.1 56.15,28.8 55.84,29.12 55.84,29.97 R30.2 R34.1
N$7
  Bottom 0.254: U11.5 182.05,128.34 182.52,128.81 182.52,135.16 181.88,135.8 181.88,136.97 C16.2 181.78,139.01 Y1.2
N$8
  Bottom 0.254: U11.6 185.04,127.84 186.64,129.45 186.64,136.97 C17.2 186.75,139.33 Y1.1
N$9
  Bottom 0.254: LED9.A 25.97,147.47 R75.1
N$10
  Bottom 0.254: R26.1 70.11,12.73 J8.1
N$11
  Bottom 0.254: R47.2 187.92,17.69 188.55,18.33 195,18.33 196,17.33 VR10.2
N$12
  Bottom 0.254: R67.1 18.03,147.47 LED1.A
N$13
  Bottom 0.254: U11.47 168.46,129.84 167.44,128.81 C2.1
N$14  (via drill 0.33)
  Top 0.254: VR6.1 73.5,31.77 v73.3,31.98 | v59.96,62.14 v55.84,62.14
  Bottom 0.254: v73.3,31.98 73.3,32.91 R25.2 73.32,32.93 71.71,32.93 70.76,33.88 62.5,33.88 | R35.2 62.29,33.67 62.5,33.88 | 62.5,33.88 62.5,61.19 61.55,62.14 v59.96,62.14 | U4.9 35.52,62.14 35.83,61.82 36.68,61.82 R40.1 C37.1 39.54,62.14 v55.84,62.14
N$15  (via drill 0.33)
  Top 0.254: VR6.3 78.5,18.13 v78.69,18.33 | v78.69,21.18 78.69,24.36 v77.74,25.31
  Bottom 0.254: v78.69,18.33 v78.69,21.18 | v77.74,25.31 63.14,25.31 62.5,25.95 U7.6 62.5,28.48 62.19,28.8 62.19,29.97 R31.1
N$16
  Bottom 0.254: R68.1
  Bottom 0.406: R68.1 33.91,147.47 LED2.A
N$17
  Bottom 0.254: U1.16 151.96,109.06 151.4,108.5 151.4,102.78 149.18,100.56 C21.+ 152.25,99.29 C20.1
N$18
  Bottom 0.254: R10.1 R12.2 C23.1 91.93,101.3 96.47,96.75 110.44,96.75 124.41,110.72 144.1,110.72 144.42,110.4 C25.-
N$19
  Bottom 0.254: U11.31 171.97,119.53 171.41,118.97 C1.1
N$20
  Bottom 0.254: R5.2 78.91,93.04 80.6,91.35 80.6,84 J1.S
N$21
  Top 0.254: J1.C 86,86.39 86,87.54 85.68,87.86 73.68,87.86 J2.S
  Bottom 0.254: R6.2 65.69,87 69.17,87 J2.S
N$22
  Bottom 0.254: R9.1 R11.2 C22.1 92.45,98.55 95.2,95.8 113.94,95.8 123.14,105 C24.-
N$23  (via drill 0.33)
  Top 0.254: v138.7,112.62 138.7,102.7 138.5,102.5 VR2.3R2
  Bottom 0.254: C27.- 140.29,121.19 138.7,119.61 v138.7,112.62
N$24
  Bottom 0.254: U7.7 63.77,28.48 64.09,28.8 64.09,29.97 R31.2 R35.1
N$25
  Bottom 0.254: U3.6 139.97,92.62 140.29,92.94 141.46,92.94 C28.1 R16.2 143.47,92.3 143.78,91.98 145.05,91.98 145.37,91.67 R13.1
N$26
  Bottom 0.254: R28.1 100.27,12.73 J9.1
N$27  (via drill 0.33)
  Top 0.254: v182.2,78.02 192,78.02 196,74.02 VR11.2
  Bottom 0.254: R49.2 180.32,79.89 v182.2,78.02
N$28
  Bottom 0.254: R17.2 147.28,90.4 146.96,90.08 143.78,90.08 143.47,90.4 R16.1 C28.2 141.46,91.03 140.29,91.03 139.97,91.35 U3.7
N$29
  Bottom 0.254: R76.1
  Bottom 0.406: R76.1 42.48,147.47 LED10.A
N$30  (via drill 0.33)
  Top 0.254: v103.46,31.66 103.5,31.62 VR7.1 103.47,16.1 101.56,16.1 98.38,19.28 v74.57,19.28 | v66.31,18.64 66.95,19.28 v72.03,19.28
  Bottom 0.254: v103.46,31.66 R27.2 109.59,33.03 110.44,33.88 110.44,41.19 109.81,41.82 109.81,60.55 111.18,61.92 C38.1 R41.1 116.58,61.92 116.8,62.14 U5.6 | R36.2 62.29,15.37 62.82,14.83 65.36,14.83 65.68,15.15 65.68,18.01 v66.31,18.64 | v72.03,19.28 v74.57,19.28
N$31
  Bottom 0.254: U3.5 138.44,95.1 136,97.55 VR2.2R1
N$32
  Bottom 0.254: U3.2 131.08,91.35 130.76,91.67 129.91,91.67 C29.1 R15.2 127.91,91.03 127.59,90.72 126.32,90.72 126.11,90.5 126.11,89.86 R14.1
N$33
  Bottom 0.254: R18.2 124.1,89.13 124.41,88.81 127.59,88.81 127.91,89.13 R15.1 C29.2 129.91,89.76 130.76,89.76 131.08,90.08 U3.1
N$34
  Bottom 0.254: LED3.A 173.1,147.44 171.3,149.24 R69.1
N$35
  Bottom 0.254: R32.1 62.19,19.06 62.19,19.91 62.5,20.23 U7.9 62.5,23.72 62.82,24.04 65.36,24.04 67.58,21.82 107.59,21.82 108.5,20.91 VR7.3
N$36  (via drill 0.33)
  Top 0.254: v119.97,98.97 v119.97,112.94
  Bottom 0.254: v119.97,112.94 R63.1
  Bottom 0.406: J15.1 107.67,86.67 v119.97,98.97
N$37
  Bottom 0.254: R63.2 119.97,117.07 120.61,117.7 121.56,117.7 121.88,118.02 Q2.B
N$38
  Bottom 0.254: R64.2 122.5,111.02 110.41,98.94 S4.3
N$39
  Bottom 0.254: R77.1 180.83,153.25 180,152.42 180,148.47 LED11.A
N$40
  Bottom 0.254: R70.1 188.76,153.25 188,152.49 188,148.47 LED4.A
N$41
  Bottom 0.254: LED12.A 196,148.47 196,152.5 196.7,153.2 R78.1
N$42
  Bottom 0.254: U2.7 60.28,95.8 60.6,95.48 60.6,94.05 60.76,93.89 74.89,93.89 76,95 VR1.2R1 76.56,99.5 77.94,99.5 VR1.3R1 81.59,98.94 83.78,96.75 84.94,96.75 R9.2
N$43
  Bottom 0.254: R67.2 18.05,144.37 19,143.42 152.35,143.42 154.9,145.96 158.7,145.96 159.02,146.28 159.02,148.18 159.34,148.5 U13.15
N$44
  Bottom 0.254: R75.2 25.99,144.69 26.62,144.06 151.72,144.06 154.9,147.23 U13.1
N$45
  Bottom 0.254: R68.2 33.93,145.01 34.25,144.69 151.09,144.69 154.9,148.5 U13.2
N$46
  Bottom 0.254: R76.2 43.67,145.75 44.09,145.32 150.45,145.32 154.9,149.77 U13.3
N$47
  Bottom 0.254: U13.4 159.18,151.04 159.66,150.56 161.09,150.56 162.2,151.68 165.37,151.68 166.01,152.31 168.87,152.31 169.18,151.99 R69.2
N$48
  Bottom 0.254: U13.5 160.29,152.31 160.93,152.94 164.58,152.94 165.06,152.63 165.53,152.63 165.85,152.94 169.18,152.94 169.5,153.26 172.36,153.26 173.63,154.53 R77.2
N$49
  Bottom 0.254: U13.6 160.77,153.58 161.4,154.22 165.37,154.22 165.85,153.9 172.04,153.9 173.94,155.8 R70.2
N$50
  Bottom 0.254: U13.7 159.02,154.85 161.25,157.07 194.58,157.07 194.9,156.75 194.9,155.91 R78.2
N$51  (via drill 0.33, 0.35)
  Top 0.254: v59.96,105.95 74.89,105.95 75.88,104.97 v75.88,103.5
  Bottom 0.254: U2.1 59.01,105 v59.96,105.95 | R10.2 81.77,103 80.21,101.44 VR1.3R2 77.94,100.88 76.56,100.88 VR1.2R2 75.88,101.56 v75.88,103.5
N$52
  Bottom 0.254: VR1.1R1 68.78,98.94 R7.1
N$53
  Bottom 0.254: VR1.1R2 68.83,101.44 R8.1
N$54
  Bottom 0.254: R5.1 U2.6 61.55,98.34 62.19,98.97 R7.2
N$55
  Bottom 0.406: R82.2 51.53,115.48 C51.+ 54.07,115.3 54.88,116.12 57.58,116.12 U9.3
N$56
  Bottom 0.254: J6.1 18.5,15.15 VR3.3
N$57
  Bottom 0.254: J14.1 112.64,151.96 113.94,153.26 R62.1
N$58
  Bottom 0.254: U2.2 60.28,100.88 | 60.28,100.88 60.91,100.24 64.72,100.24 66,101.51 R8.2 | R6.1 59.65,100.24 60.28,100.88
N$59
  Bottom 0.254: U1.26 155.92,115.56 156.48,116.12 156.48,122.47 156.16,122.78 C19.2 156.01,123.99 Y2.1
N$60
  Bottom 0.254: U1.25 156.22,114.91 157.12,115.8 157.12,122.78 157.44,123.1 157.44,128.5 156.16,129.77 C18.2 156.06,131.04 155.21,131.04 152.61,133.64 Y2.2
N$61
  Bottom 0.254: U3.3 131.4,92.62 130.76,93.25 130.76,102.78 131.4,103.41 135.21,103.41 136,102.62 VR2.2R2
N$62
  Bottom 0.254: R36.1 R32.2 64.09,19.06 64.09,19.91 63.77,20.23 U7.8
N$63
  Bottom 0.254: J5.1 37.72,86.67 R20.1
N$64
  Bottom 0.254: R43.1 130.43,12.73 J10.1
N$65
  Bottom 0.254: R79.1 90.97,135.8 89.81,135.8 87.92,133.91 LED13.A
N$66
  Bottom 0.254: R62.2 117.01,153.16 116.16,152.31 116.16,151.68 115.84,151.36 115.38,151.36 Q1.B
N$67
  Bottom 0.254: R71.1 80.81,135.8 79.65,135.8 77.76,133.91 LED5.A
N$68
  Bottom 0.254: R72.1 100.82,135.8 99.64,135.8 97.75,133.91 LED6.A
N$69
  Bottom 0.254: R80.1 110.98,135.8 109.81,135.8 107.92,133.91 LED14.A
N$70
  Bottom 0.254: R73.1 120.82,135.8 119.75,135.8 117.86,133.91 LED7.A
N$71
  Bottom 0.254: R81.1 130.98,135.8 130,135.8 128.12,133.91 LED15.A
N$72
  Bottom 0.254: R74.1 140.5,135.8 139.5,135.8 137.62,133.91 LED8.A
N$73
  Bottom 0.254: R28.2 97.75,18.01 98.06,18.33 105.68,18.33 106,18.01 VR7.2
N$74
  Bottom 0.254: U14.15 159.97,137.07 159.18,137.86 159.18,142.31 158.7,142.78 87.27,142.78 82.82,138.34 82.82,134.53 82.19,133.9 81.02,133.9 R71.2
N$75
  Bottom 0.254: R79.2 91.08,130.4 92.98,128.5 146.32,128.5 148.86,131.04 148.86,136.12 149.81,137.07 154.9,137.07 156.16,135.8 U14.1
N$76
  Bottom 0.254: R72.2 100.92,130.72 102.19,129.45 145.69,129.45 147.91,131.67 147.91,136.12 149.5,137.7 155.21,137.7 155.85,137.07 U14.2
N$77
  Bottom 0.254: R80.2 111.08,131.35 112.03,130.4 145.05,130.4 146.96,132.31 146.96,137.07 148.23,138.34 U14.3
N$78
  Bottom 0.254: R73.2 120.92,132.94 122.51,131.35 144.42,131.35 146,132.94 146,138.34 147.28,139.61 U14.4
N$79
  Bottom 0.254: R81.2 131.08,132.94 131.72,132.31 143.78,132.31 144.89,133.42 145.05,133.58 145.05,139.61 146.32,140.88 U14.5
N$80
  Bottom 0.254: R74.2 143.57,134 144.1,134.53 144.1,140.56 145.69,142.15 U14.6
N$81
  Bottom 0.254: U5.14 122.19,55.79 121.88,56.11 121.88,58.01 122.19,58.33 U5.12
N$82  (via drill 0.33)
  Top 0.254: v12.97,62.46 v10.11,62.46 | v51.39,18.01 v51.39,13.88
  Bottom 0.203: 49.48,24.67 49.48,27.56 46.31,30.74 32.62,30.74 30.75,32.61
  Bottom 0.254: R19.2 8.31,68.7 9.48,67.54 | v12.97,62.46 13.5,61.92 C34.1 R37.1 25.46,61.82 26.62,61.82 26.94,62.14 U4.6 30.12,62.14 30.75,61.5 30.75,32.61 | 9.48,67.54 9.48,63.09 v10.11,62.46 | 49.48,24.67 49.48,19.91 v51.39,18.01 | v51.39,13.88 52.02,13.25 57.1,13.25 57.64,13.78 R33.2 | VR4.1 13.5,71.56 9.48,67.54
N$83
  Bottom 0.254: VR3.2 16,25.14 13.61,27.53 R22.1
N$84  (via drill 0.33)
  Top 0.254: v29.8,48.49 34.88,48.49 39.33,44.04 50.44,44.04 v51.39,43.09 | v51.39,33.88 51.39,26.9 52.66,25.63 56.47,25.63 57.42,24.67 v57.42,23.72
  Bottom 0.254: R29.1 57.74,19.06 57.74,19.91 57.42,20.23 U7.13 v57.42,23.72 | v29.8,48.49 27.89,50.39 13.29,50.39 12,51.68 12,64 18.5,70.5 VR4.3 | v51.39,43.09 v51.39,33.88
N$85
  Bottom 0.254: R33.1 R29.2 55.84,19.06 55.84,19.91 56.15,20.23 U7.14
N$86
  Bottom 0.254: R26.2 67.58,18.33 67.9,18.64 75.52,18.64 76,18.16 VR6.2
N$87  (via drill 0.33)
  Top 0.254: v20.59,57.38 9.48,57.38 8.53,56.42 8.53,32.3 v9.8,31.02
  Bottom 0.254: R21.2 R22.2 13.5,31.02 v9.8,31.02 | U4.2 26.94,57.06 26.62,57.38 25.46,57.38 R38.1 C35.1 20.69,57.27 v20.59,57.38
N$88  (via drill 3.5 pad 5)
  other vias: 6,151.66
N$89  (via drill 3.5 pad 5)
  other vias: 206,151.66
N$90
  Bottom 0.254: R45.1 160.6,12.73 J11.1
N$91
  Bottom 0.254: R24.2 37.74,17.69 38.06,18.01 45.36,18.01 45.99,17.37 45.99,16.15 VR5.2
N$92  (via drill 0.33)
  Top 0.254: VR8.1 133.5,17.37 | 133.5,17.37 133.5,31.54 v133.62,31.66 | v152.99,15.15 144.74,15.15 141.56,18.33 134.45,18.33 133.5,17.37 | v171.09,57.06 154.26,57.06 152.35,55.16 v151.4,55.16
  Bottom 0.254: v133.62,31.66 R42.2 141.03,33.03 141.56,33.56 141.56,43.73 143.47,45.63 143.47,53.25 145.37,55.16 v151.4,55.16 | U6.2 176.49,57.06 176.27,57.27 R58.1 C39.1 171.3,57.27 v171.09,57.06 | R54.2 153.41,15.57 v152.99,15.15
N$93  (via drill 0.33)
  Top 0.254: v145.05,17.69 152.99,17.69 v153.31,18.01
  Bottom 0.254: U8.9 153.62,20.55 153.31,20.23 153.31,19.38 R50.1 153.31,19.17 v153.31,18.01 | VR8.3 143.39,16.03 v145.05,17.69
N$94
  Bottom 0.254: U8.8 154.9,20.55 155.21,20.23 155.21,19.38 R50.2 R54.1
N$95
  Bottom 0.254: R47.1 190.44,12.73 J12.1
N$96
  Bottom 0.254: R45.2 158.07,17.69 158.7,18.33 165.37,18.33 166.01,17.69 166.01,16.15 VR9.2
N$97  (via drill 0.33)
  Top 0.254: VR9.1 163.5,31.31 v163.47,31.34
  Bottom 0.254: v163.47,31.34 R44.2 | R44.2 178.81,33.03 179.99,33.96 180.3,34.27 180.3,61.5 179.66,62.14 U6.6 176.8,62.14 176.49,61.82 175.32,61.82 R59.1 C40.1 | R55.2 148.76,34.1 149.18,34.52 160.29,34.52 161.56,33.25 163.25,33.25 R44.2
N$98
  Bottom 0.254: R51.1 148.76,29.34 148.55,29.12 U8.2 148.55,25.31 149.5,24.36 156.48,24.36 157.12,23.72 157.12,21.18 157.75,20.55 167.91,20.55 168.5,19.96 VR9.3
N$99
  Bottom 0.254: R55.1 R51.2 147.06,29.34 147.28,29.12 U8.1
N$100  (via drill 3.2)
  other vias: 53.77,135.69
N$101
  Bottom 0.254: U5.10 122.19,60.87 121.88,61.19 121.88,63.09 122.19,63.41 U5.8
N$102  (via drill 0.33)
  Top 0.254: VR10.1 193.5,32.48 v193.95,32.93
  Bottom 0.254: R46.2 199.88,32.93 v193.95,32.93 193.63,33.25 182.83,33.25 181.56,34.52 | C41.1 R60.1 186.54,57.38 185.69,57.38 185.38,57.06 U6.13 182.2,57.06 181.56,56.42 181.56,34.52 | R56.2 153.41,32.51 154.26,31.66 154.26,26.26 154.9,25.63 172.68,25.63 181.56,34.52
N$103
  Bottom 0.254: VR10.3 198.5,24.99 196.28,27.22 178.07,27.22 175.85,24.99 154.58,24.99 153.62,25.95 U8.6 153.62,29.12 153.41,29.34 R52.1
N$104
  Bottom 0.254: R56.1 R52.2 155.11,29.34 154.9,29.12 U8.7
N$105
  Bottom 0.254: J13.1 177.79,79.95 R49.1
N$106
  Bottom 0.254: R20.2 22,86.59 16,80.59 VR4.2
N$107  (via drill 0.33)
  Top 0.254: v189.5,60.87 192.36,60.87 v193,61.5 | v165.69,19.59 v188.87,19.59 | v195.85,19.59 202.84,19.59 204.74,21.5 204.74,58.65 v200.62,62.77
  Bottom 0.254: v189.5,60.87 189.19,61.19 R61.1 C42.1 185.59,61.92 185.38,62.14 U6.9 | v193,61.5 199.66,61.5 200.62,62.46 v200.62,62.77 200.62,66.8 R48.2 200.62,67 196,67 193.5,69.5 VR11.1 | R57.2 148.76,14.62 149.18,14.2 155.85,14.2 156.16,14.52 156.16,18.64 157.12,19.59 v165.69,19.59 | v188.87,19.59 v195.85,19.59
N$108  (via drill 0.33)
  Top 0.254: v194.9,18.96 203.47,18.96 205.5,20.99 205.5,68 200.83,72.67 VR11.3 | v187.92,18.96 v164.74,18.96
  Bottom 0.254: v194.9,18.96 v187.92,18.96 | v164.74,18.96 157.44,18.96 156.8,18.33 156.8,14.2 156.16,13.56 148.55,13.56 147.91,14.2 147.91,17.69 148.55,18.33 148.55,19.06 R53.1 148.55,19.49 U8.13
N$109
  Bottom 0.254: R57.1 R53.2 147.28,19.49 U8.14
N$110  (via drill 3.2)
  other vias: 203,144.9
N$111
  Bottom 0.254: U5.3 120.29,58.33 120.61,58.01 120.61,56.11 120.29,55.79 U5.1
N$112  (via drill 0.33)
  Top 0.254: v159.97,154.53 v159.97,138.97
  Bottom 0.254: U14.14 160.61,138.34 v159.97,138.97 | v159.97,154.53 161.56,156.12 U13.9
N$113  (via drill 3.2)
  other vias: 180,9
N$114  (via drill 3.2)
  other vias: 32,9
N$117  (via drill 0.6)
  other vias: 148.86,123.73
PITCH_CV  (via drill 0.33)
  Top 0.254: v71.08,70.39 v186.64,70.39 | v68.53,53.57 25.67,53.57 v25.36,53.89
  Bottom 0.254: U11.15 183.23,123.34 183.75,122.82 183.75,98.38 184.11,98.02 184.11,80.87 187.28,77.7 187.28,70.71 186.96,70.39 v186.64,70.39 | v71.08,70.39 70.76,70.39 70.12,69.76 70.12,55.16 v68.53,53.57 | C35.2 R38.2 | R38.2 26.73,55.58 26.94,55.79 U4.1 | v25.36,53.89 R38.2
PITCH_POT  (via drill 0.33)
  Top 0.254: VR15.2 16,36.25 16.47,35.79 147.59,35.79 149.18,37.38 v149.18,57.38
  Bottom 0.254: U12.2 149.81,63.09 149.18,62.46 v149.18,57.38
POSITION_CV  (via drill 0.33)
  Top 0.254: v33.61,71.35 v188.07,71.35
  Bottom 0.254: U11.14 183.68,123.84 184.42,123.1 184.42,105.5 186.25,103.67 186.25,99.25 185.88,98.88 185.88,80.06 188.23,77.7 188.23,71.51 v188.07,71.35 | C34.2 R37.2 25.46,63.73 26.31,63.73 26.62,63.41 U4.7 28.47,65.25 31.07,67.86 31.07,71.03 31.39,71.35 v33.61,71.35
POSITION_POT  (via drill 0.33, 0.35)
  Top 0.254: v29.8,68.17 29.8,62.46 30.75,61.5 149.5,61.5 v150.13,60.87 | v27,72 VR14.2
  Bottom 0.254: v150.13,60.87 150.77,60.87 151.09,61.19 151.09,61.72 U12.1 | v29.8,68.17 29.8,69.2 v27,72
RESET
  Bottom 0.254: U11.7 197.64,127.34 199.34,125.64 199.34,114.84 201.25,112.94 P1.10 205.69,110.61 R1.1 SJ1.2
REVERB_CV
  Bottom 0.254: U11.23 175.97,119.65 176.8,118.81 176.8,116.12 182.2,110.72 182.2,106.91 180.5,105.21 180.5,81.94 183.79,78.65 183.79,69.44 186.01,67.22 189.5,67.22 190.77,65.95 190.77,56.42 189.92,55.58 C41.2 R60.2 186.54,55.47 185.69,55.47 185.38,55.79 U6.14
REVERB_POT  (via drill 0.33)
  Top 0.254: v163.47,37.38 195.22,37.38 196,38.16 VR13.2
  Bottom 0.254: U12.15 161.25,63.09 162.2,62.14 162.2,38.65 v163.47,37.38
RIN
  Bottom 0.254: C24.+ 149.19,106.92 150.77,108.5 150.77,110.4 151.37,111 U1.19
ROUT  (via drill 0.33)
  Top 0.254: v158.07,109.13 150.77,109.13 149.81,110.08 v149.81,113.58
  Bottom 0.254: U1.13 158.15,109.06 v158.07,109.13 | v149.81,113.58 149.81,115.17 C26.+
ROUT_JACK
  Bottom 0.254: R17.1 150.24,92.84 151.4,91.67 151.4,85.43 J3.S
SPREAD_CV  (via drill 0.33)
  Top 0.254: v176.8,123.1 176.49,123.1 176.17,122.78 176.17,122.47 177.75,120.88 177.75,116.43 179.03,115.16 179.03,112.12 174.58,107.68 v174.58,106.59 | v163.78,55.47 v171.09,55.47
  Bottom 0.254: U6.1 176.8,55.79 176.49,55.47 175.32,55.47 R58.2 C39.2 172.57,55.47 v171.09,55.47 | U11.21 176.97,122.94 v176.8,123.1 | v174.58,106.59 174.58,100.58 159.5,85.5 159.5,74.5 163,71 163,56.26 v163.78,55.47
SPREAD_POT  (via drill 0.33)
  Top 0.254: VR12.2 136,38.81 136.48,38.33 144.1,38.33 144.74,38.96 v144.74,41.5
  Bottom 0.254: U12.13 155.85,65.63 153.94,63.73 153.94,43.41 152.99,42.45 145.69,42.45 v144.74,41.5
SW_BUF  (via drill 0.33)
  Top 0.254: v174.26,137.7 173.94,138.02 142.19,138.02 141.56,138.66 141.56,144.37 139.66,146.28 v138.38,146.28
  Bottom 0.254: U11.58 175.97,133.78 174.26,135.48 v174.26,137.7 | S1.3 S1.4 93.36,154.16 101.56,145.96 138.07,145.96 v138.38,146.28
SW_CAPT  (via drill 0.33)
  Top 0.254: v175.22,151.04 175.22,155.33 173.94,156.6 130.94,156.6 S2.4
  Bottom 0.254: U11.59 176.47,134.23 175.22,135.48 v175.22,151.04 | S2.3 S2.4
SW_FREEZE  (via drill 0.33)
  Top 0.254: v132.35,125.32 132.99,125.96 137.43,125.96 141.24,122.15 158.39,122.15 162.36,126.12 v179.34,126.12
  Bottom 0.254: S4.2 116,124.21 117.11,125.32 v132.35,125.32 | U11.10 179.62,125.84 v179.34,126.12
SW_MEM  (via drill 0.33)
  Top 0.254: v173.31,143.46 174.25,144.4 174.25,153.75 172.2,155.8 150.14,155.8 S3.4
  Bottom 0.254: S3.3 S3.4 | U11.57 175.47,133.33 173.31,135.48 v173.31,143.46
TEXTURE_CV  (via drill 0.33)
  Top 0.254: v41.55,63.73 151.4,63.73 152.04,63.09 v166.01,63.09 | v178.71,119.29 178.71,116.43 179.66,115.48 179.66,111.5 175.53,107.37 v175.53,105.64
  Bottom 0.254: U4.8 35.52,63.41 35.83,63.73 36.68,63.73 R40.2 C37.2 41.44,63.62 v41.55,63.73 | U11.17 178.97,119.55 v178.71,119.29 | v175.53,105.64 175.53,100.53 160.5,85.5 160.5,74.5 167,68 167,64.09 v166.01,63.09
TEXTURE_POT  (via drill 0.33)
  Top 0.254: VR18.2 76,37.53 76.47,37.06 145.69,37.06 146.96,38.33 v146.96,57.38
  Bottom 0.254: U12.5 147.59,66.9 146.96,66.27 v146.96,57.38
VCC  (via drill 0.33)
  Top 0.406: v58.06,88.81 132.99,88.81 135.21,86.59 138.38,86.59 v138.7,86.91 | v55.2,96.75 49.48,96.75 45.34,100.89 45.34,123.75 v45.04,124.05 | v151.09,29.44 v134.57,29.44 | v67.58,29.44 v59.96,29.44
  Bottom 0.254: 58.85,96.85 U2.8 | C32.1 138.6,89.92 U3.8
  Bottom 0.406: C30.1 58.85,96.85 | C30.1 57.1,89.76 v58.06,88.81 58.06,34.52 58.69,33.88 58.69,30.71 59.01,30.39 59.75,30.39 C63.1 v59.96,29.44 U7.4 | v138.7,86.91 138.7,88.07 C32.1 | v55.2,96.75 57,96.75 C30.1 | C54.+ 44.27,124.83 v45.04,124.05 | U8.4 v151.09,29.44 C60.1 | v134.57,29.44 v67.58,29.44
  Bottom 1.016: P2.3 30.26,129.16 35.02,124.39 38.25,124.39 C54.+
VEE  (via drill 0.33)
  Top 0.406: v64.41,101.19 64.41,97.38 65.36,96.43 v132.99,96.43 | v59.96,19.91 60.28,20.23 v72.03,20.23 | v74.57,20.23 v101.87,20.23 | v104.73,20.23 125.37,20.23 | 125.37,20.23 v132.03,20.23 | v134.57,20.23 v151.09,20.23 | v126.95,30.71 126.95,21.82 125.37,20.23
  Bottom 0.406: C31.2 62.86,102.25 U2.4 | C31.2 v64.41,101.19 | R83.1 5.35,138.17 6.87,139.79 C55.- 62.01,139.79 66.31,135.48 66.31,103.13 65.43,102.25 C31.2 | v132.99,96.43 132.99,95.8 132.67,95.48 C33.2 131.62,94.31 132.03,93.89 U3.4 134.57,93.89 135.21,93.25 135.21,44.99 130.13,39.91 130.13,33.88 v126.95,30.71 | C62.2 v59.96,19.91 U7.11 | v72.03,20.23 v74.57,20.23 | v101.87,20.23 v104.73,20.23 | v132.03,20.23 v134.57,20.23 | C61.2 v151.09,20.23 U8.11
  Bottom 1.016: C55.- 37.08,139.79 30.4,133.12 P2.2

## Text on the board
tPlace: YLW | YLW | YLW | YLW | BANANA | YLW | YLW | YLW | YLW | GRN | GRN | GRN | GRN | GRN | YLW | RED | ALPHA | ALPHA | RD910F-50K | RD910F-50K | 17mm Pot | 17mm Pot | BANANA | NON-SW | SW | BANANA | NON-SW | NON-SW | BANANA | BANANA | BANANA | BANANA | BANANA | BANANA | BANANA | BANANA
bPlace: 74HC595 | YLW | YLW | YLW | YLW | 74HC595 | YLW | YLW | YLW | YLW | BANANA | U11 | GRN | GRN | GRN | GRN | GRN | YLW | RED | boot | STM32f405RGT6 | LM1117-3.3V | - | WM8731 | SW | SW | reset | TL072 | LM1117-3.3V | + | 17mm Pot | 17mm Pot | TL072 | BANANA | NON-SW | SW | BANANA | NON-SW | NON-SW | BANANA | CD4051 | Original hardware and code: / E. Gillet CC-BY-SA 3.0 | BANANA | BANANA | BANANA | BANANA | BANANA | BANANA | BANANA
bNames: JTAG
_tsilk1: Q3 | IC17 | B10 | IC15 | R88 | R89 | R90 | R92 | LED1 | LED2 | LED3 | LED4 | R84 | C59 | C58 | R86 | LED6 | LED7 | LED8 | R81 | R83 | R85 | LED5 | Q2 | SW1 | SW3 | SW5 | SW4 | LED9 | LED10 | LED11 | LED12 | LED13 | LED14 | LED15 | C10 | C9 | R96 | C8 | C7 | R98 | R99 | R100 | R101 | R102 | C66 | R103 | C13 | C14 | C62 | C65 | IC18 | R4 | D2 | C1 | Q4 | R1 | R2 | C12 | R93 | R80 | D1 | C61 | C64 | + | C32 | C11 | C2 | R3 | C24 | IC20 | R105 | C20 | C19 | R6 | * | R95 | R75 | C15 | R87 | R12 | IC1 | R76 | C18 | SW | C16 | SW | C31 | C28 | C17 | C68 | R14 | C23 | Q1 | R17 | R18 | C33 | C4 | C67 | IC3 | R5 | C25 | - | R104 | R9 | R10 | C5 | R19 | R16 | C30 | C27 | C26 | IC4 | C63 | R15 | R7 | R20 | C22 | R8 | R11 | C3 | C6 | R13 | IC19 | B11 | B1 | J3 | J1 | C29 | R25 | J4 | J2 | B7 | R60 | R26 | R61 | C34 | C37 | C47 | IC12 | IC6 | R28 | C21 | R59 | C40 | R42 | C51 | C57 | R32 | C42 | R44 | IC16 | C60 | IC5 | IC11 | R21 | R27 | R41 | R62 | R58 | R57 | C46 | C53 | R94 | R97 | R91 | R82 | R77 | R78 | R79 | C39 | C41 | C52 | C35 | C38 | C48 | C49 | C36 | C50 | IC10 | IC14 | IC8 | R73 | R36 | R55 | R47 | R67 | R24 | R50 | R63 | R22 | R33 | R45 | R34 | R69 | R56 | R74 | C43 | R68 | C44 | R31 | R43 | C45 | R51 | R40 | R53 | IC9 | R65 | R71 | IC13 | R30 | R38 | IC7 | R49 | R54 | R72 | R35 | R66 | R23 | R46 | C54 | C55 | C56 | R39 | R52 | R64 | R70 | R29 | R37 | R48 | B4 | B6 | B8 | B9 | B2 | B3 | B5
_bsilk1: B10 | GND | -15V | +15V | NULL | + | JTAG | * | SW | SW | GND | - | <TX | FTDI DONGLE | B11 | B1 | J3 | J1 | C | C | G | J4 | S | G | J2 | S | B7 | S | G | S | G | Stereo Microsound Processor | Original hardware and code by Olivier Gillet CC-BY-SA-3.0 | B4 | B6 | B8 | B9 | B2 | B3 | B5